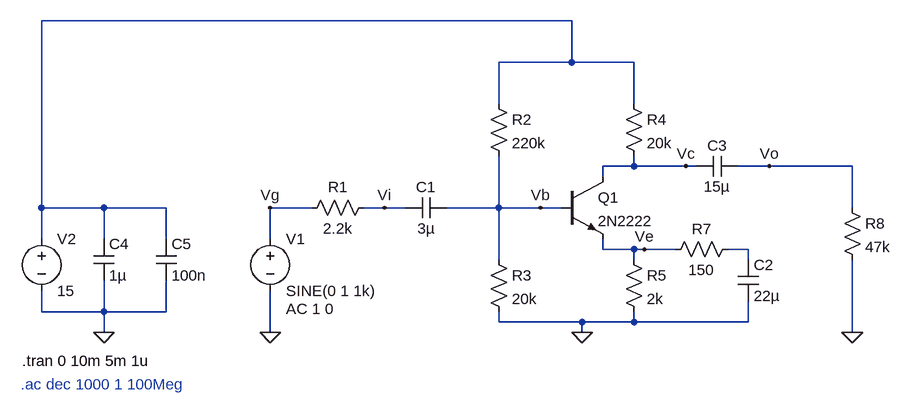
[diagram p0: schematic Emissor_Comum.asc]
Emissor_Comum.asc, the LTspice schematic file:
Version 4
SHEET 1 1092 680
WIRE 496 -160 -320 -160
WIRE 496 -96 496 -160
WIRE 496 -96 384 -96
WIRE 592 -96 496 -96
WIRE 384 -32 384 -96
WIRE 592 -32 592 -96
WIRE 592 64 592 48
WIRE 592 64 544 64
WIRE 672 64 592 64
WIRE 688 64 672 64
WIRE 800 64 752 64
WIRE 928 64 800 64
WIRE 544 80 544 64
WIRE -320 128 -320 -160
WIRE -224 128 -320 128
WIRE -128 128 -224 128
WIRE 96 128 32 128
WIRE 208 128 176 128
WIRE 240 128 208 128
WIRE 384 128 384 48
WIRE 384 128 304 128
WIRE 448 128 384 128
WIRE 480 128 448 128
WIRE 928 128 928 64
WIRE -320 176 -320 128
WIRE -224 176 -224 128
WIRE -128 176 -128 128
WIRE 32 176 32 128
WIRE 544 192 544 176
WIRE 592 192 544 192
WIRE 608 192 592 192
WIRE 656 192 608 192
WIRE 768 192 736 192
WIRE 384 208 384 128
WIRE 592 208 592 192
WIRE 768 208 768 192
WIRE -320 288 -320 256
WIRE -224 288 -224 240
WIRE -224 288 -320 288
WIRE -128 288 -128 240
WIRE -128 288 -224 288
WIRE 384 304 384 288
WIRE 512 304 384 304
WIRE 592 304 592 288
WIRE 592 304 512 304
WIRE 768 304 768 272
WIRE 768 304 592 304
WIRE -224 320 -224 288
WIRE 32 320 32 256
WIRE 512 320 512 304
WIRE 928 320 928 208
FLAG -224 320 0
FLAG 32 320 0
FLAG 512 320 0
FLAG 208 128 Vi
FLAG 672 64 Vc
FLAG 608 192 Ve
FLAG 448 128 Vb
FLAG 800 64 Vo
FLAG 32 128 Vg
FLAG 928 320 0
SYMBOL voltage 32 160 R0
WINDOW 123 24 124 Left 2
WINDOW 39 0 0 Left 0
SYMATTR InstName V1
SYMATTR Value SINE(0 1 1k)
SYMATTR Value2 AC 1 0
SYMBOL res 192 112 R90
WINDOW 0 0 56 VBottom 2
WINDOW 3 32 56 VTop 2
SYMATTR InstName R1
SYMATTR Value 2.2k
SYMBOL cap 304 112 R90
WINDOW 0 0 32 VBottom 2
WINDOW 3 32 32 VTop 2
SYMATTR InstName C1
SYMATTR Value 3µ
SYMBOL res 368 -48 R0
SYMATTR InstName R2
SYMATTR Value 220k
SYMBOL res 368 192 R0
SYMATTR InstName R3
SYMATTR Value 20k
SYMBOL npn 480 80 R0
SYMATTR InstName Q1
SYMATTR Value 2N2222
SYMBOL res 576 -48 R0
SYMATTR InstName R4
SYMATTR Value 20k
SYMBOL res 576 192 R0
SYMATTR InstName R5
SYMATTR Value 2k
SYMBOL cap 752 208 R0
SYMATTR InstName C2
SYMATTR Value 22µ
SYMBOL cap 752 48 R90
WINDOW 0 0 32 VBottom 2
WINDOW 3 32 32 VTop 2
SYMATTR InstName C3
SYMATTR Value 15µ
SYMBOL voltage -320 160 R0
WINDOW 123 0 0 Left 0
WINDOW 39 0 0 Left 0
SYMATTR InstName V2
SYMATTR Value 15
SYMBOL cap -240 176 R0
SYMATTR InstName C4
SYMATTR Value 1µ
SYMBOL cap -144 176 R0
SYMATTR InstName C5
SYMATTR Value 100n
SYMBOL res 752 176 R90
WINDOW 0 0 56 VBottom 2
WINDOW 3 32 56 VTop 2
SYMATTR InstName R7
SYMATTR Value 150
SYMBOL res 912 112 R0
SYMATTR InstName R8
SYMATTR Value 47k
TEXT -352 400 Left 2 ;.ac dec 1000 1 100Meg
TEXT -350 364 Left 2 !.tran 0 10m 5m 1u

The netlist it stands for:
* Emissor_Comum.asc
V1 Vg 0 SINE(0 1 1k) AC 1 0
R1 Vi Vg 2.2k
C1 Vb Vi 3µ
R2 N001 Vb 220k
R3 Vb 0 20k
Q1 Vc Vb Ve 0 2N2222
R4 N001 Vc 20k
R5 Ve 0 2k
C2 N002 0 22µ
C3 Vo Vc 15µ
V2 N001 0 15
C4 N001 0 1µ
C5 N001 0 100n
R7 N002 Ve 150
R8 Vo 0 47k
.model NPN NPN
.model PNP PNP
.lib standard.bjt
* .ac dec 1000 1 100Meg
.tran 0 10m 5m 1u
.backanno
.end